# EAGLE design schematic (EAGLE 9.3.1)
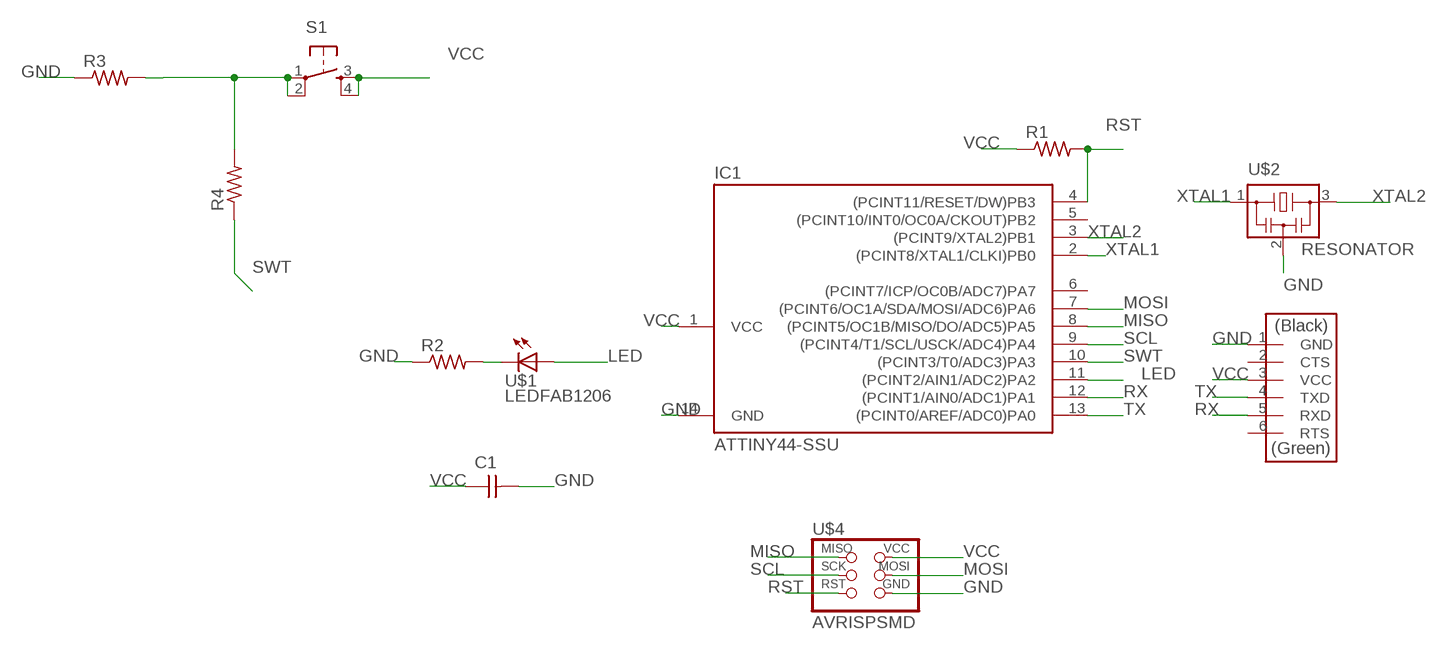
[diagram p0: schematic, sheet 1]

## Parts
C1  CAP-UNPOLARIZEDFAB  [C1206FAB]
IC1  ATTINY44-SSU  [SOIC14]
R1  RES-US1206FAB  [R1206FAB]
R2  RES-US1206FAB  [R1206FAB]
R3  RES-US1206FAB  [R1206FAB]
R4  RES-US1206FAB  [R1206FAB]
S1  6MM_SWITCH6MM_SWITCH  [6MM_SWITCH]
U$1  LEDFAB1206  [LED1206FAB]
U$2  RESONATOR  [EFOBM]
U$3  FTDI-SMD-HEADER  [1X06SMD]
U$4  AVRISPSMD  [2X03SMD]

## Nets
GND: C1.2 IC1.14(GND) R2.1 R3.1 U$2.2 U$3.1(GND) U$4.6(GND)
LED: IC1.11((PCINT2/AIN1/ADC2)PA2) U$1.1(A)
MISO: IC1.8((PCINT5/OC1B/MISO/DO/ADC5)PA5) U$4.1(MISO)
MOSI: IC1.7((PCINT6/OC1A/SDA/MOSI/ADC6)PA6) U$4.4(MOSI)
N$1: R2.2 U$1.2(C)
N$3: R3.2 R4.2 S1.1(P) S1.2(P1)
RST: IC1.4((PCINT11/RESET/DW)PB3) R1.2 U$4.5(RST)
RX: IC1.12((PCINT1/AIN0/ADC1)PA1) U$3.5(RXD)
SCL: IC1.9((PCINT4/T1/SCL/USCK/ADC4)PA4) U$4.3(SCK)
SWT: IC1.10((PCINT3/T0/ADC3)PA3) R4.1
TX: IC1.13((PCINT0/AREF/ADC0)PA0) U$3.4(TXD)
VCC: C1.1 IC1.1(VCC) R1.1 S1.3(S) S1.4(S1) U$3.3(VCC) U$4.2(VCC)
XTAL1: IC1.2((PCINT8/XTAL1/CLKI)PB0) U$2.1
XTAL2: IC1.3((PCINT9/XTAL2)PB1) U$2.3
Unconnected: IC1.5((PCINT10/INT0/OC0A/CKOUT)PB2) IC1.6((PCINT7/ICP/OC0B/ADC7)PA7) U$3.2(CTS) U$3.6(RTS)

## Library data of the parts
C1 = fab:CAP-UNPOLARIZED
IC1 = fab:ATTINY44
R1-R4 = fab:RES-US: Resistor (US Symbol) Variants with postfix FAB are widened to allow the routing of internal traces
S1 = fab:6MM_SWITCH: OMRON SWITCH
U$1 = fab:LED: LED
U$2 = fab:RESONATOR
U$3 = fab:FTDI-SMD-HEADER
U$4 = fab:AVRISP

## Board
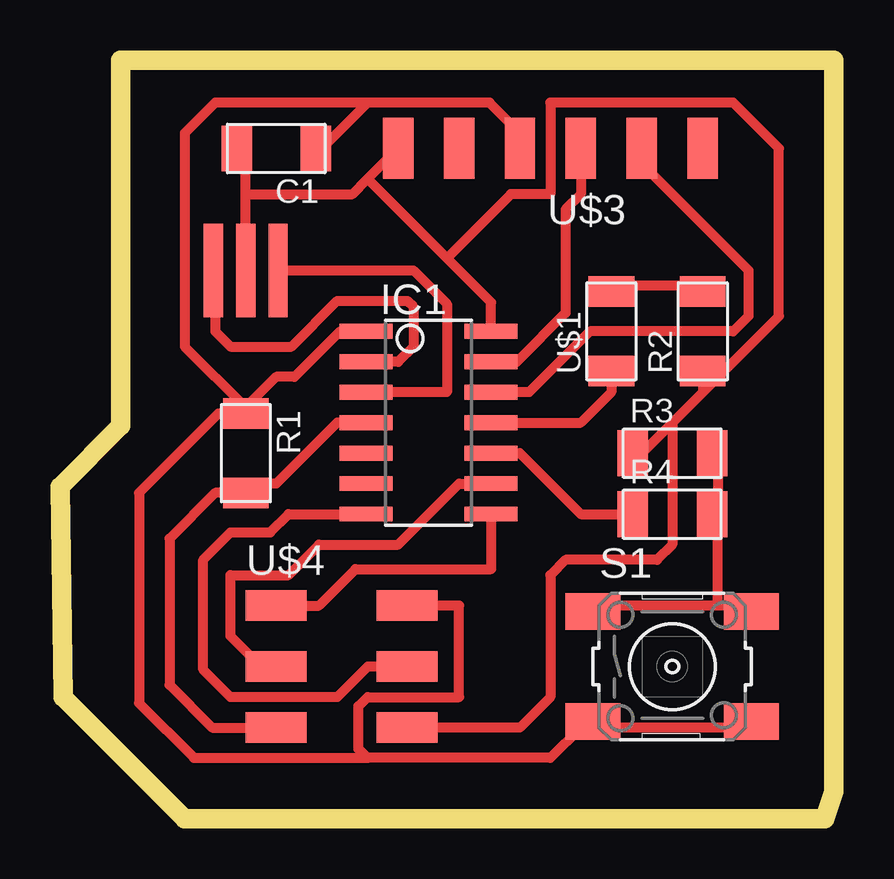
[diagram p1: board, top side]

Size 32.26 x 31.62 mm. Coordinates in mm from the lower left corner, seen from the top.
Outline: 5.21,0 31.88,0 32.26,1.14 32.26,31.62 2.54,31.62 2.54,16.38 0,13.84 0.13,5.08 5.21,0
Copper layers (1*16): Top 0.035mm / dielectric 1.5mm / Bottom 0.035mm
Design rules "default *": minimum track width 16mil, minimum drill 0.35mm, track to track 16mil, track to pad 16mil, pad to pad 16mil, via to via 16mil, smd to smd 16mil, copper to edge 40mil, drill to drill 6mil, minimum pad ring 10mil, minimum via ring 8mil, stop-mask expansion 4mil, vias tented up to drill 0mil, thermal gap 16mil

### Footprints (pad centres in the part's own frame; a part is rotated, then mirrored left to right if it is on the bottom)
C1206FAB = smd 1.27 x 1.905: 1 -1.651,0; 2 1.651,0
SOIC14 = smd 0.61 x 2.21: 1 -3.81,-2.603; 2 -2.54,-2.603; 3 -1.27,-2.603; 4 0,-2.603; 5 1.27,-2.603; 6 2.54,-2.603; 7 3.81,-2.603; 8 3.81,2.603; 9 2.54,2.603; 10 1.27,2.603; 11 0,2.603; 12 -1.27,2.603; 13 -2.54,2.603; 14 -3.81,2.603
R1206FAB = smd 1.27 x 1.905: 1 -1.651,0; 2 1.651,0
6MM_SWITCH = smd 2.286 x 1.524: 1 -3.302,2.286; 2 3.302,2.286; 3 -3.302,-2.286; 4 3.302,-2.286
LED1206FAB = smd 1.27 x 1.905: 1 -1.651,0; 2 1.651,0
EFOBM = smd 0.8 x 3.9: 1 -1.35,0; 2 0,0; 3 1.35,0
1X06SMD = smd 2.54 x 1.27: 1 0,6.35; 2 0,3.81; 3 0,1.27; 4 0,-1.27; 5 0,-3.81; 6 0,-6.35
2X03SMD = smd 2.54 x 1.27: 1 -2.54,2.54; 2 2.92,2.54; 3 -2.54,0; 4 2.92,0; 5 -2.54,-2.54; 6 2.92,-2.54

### Placement (x,y rotation side)
C1  9.02,27.94 180 top
IC1  15.37,16.51 270 top
R1  7.75,15.24 270 top
R2  26.8,20.32 90 top
R3  25.53,15.24 0 top
R4  25.53,12.7 0 top
S1  25.53,6.35 0 top
U$1  22.99,20.32 90 top
U$2  7.75,22.86 0 top
U$3  20.45,27.94 90 top
U$4  11.56,6.35 0 top

### Tracks (layer width: path | path; a pad name or v marks a point on that pad's centre or on a via)
GND
  Top 0.406: U$2.2 7.75,26.04 | 7.75,26.04 7.75,27.94 C1.2 | 12.83,26.67 16.13,23.37 | IC1.14 17.97,21.53 16.13,23.37 | 7.75,26.04 12.19,26.04 12.83,26.67 | 12.83,26.67 U$3.1 | 26.8,17.78 25.53,16.51 | 25.53,16.51 24.26,15.24 R3.1 | R2.1 26.8,17.78 | U$4.6 19.18,3.81 20.45,5.08 20.45,10.16 21.08,10.8 24.89,10.8 25.53,11.43 25.53,16.51 | 16.13,23.37 18.8,26.04 20.45,26.04 20.45,29.84 28.07,29.84 29.97,27.94 29.97,20.95 26.8,17.78
LED
  Top 0.406: U$1.1 22.99,17.78 21.72,16.51 IC1.11
MISO
  Top 0.406: IC1.8 17.97,10.41 12.32,10.41 10.79,8.89 U$4.1
MOSI
  Top 0.406: IC1.7 9.53,12.7 8.76,11.94 7.11,11.94 5.97,10.8 5.97,6.22 7.11,5.08 11.56,5.08 12.83,6.35 U$4.4
N$1
  Top 0.406: U$1.2 22.99,22.23 26.8,22.23 R2.2
N$3
  Top 0.406: 27.43,12.7 27.43,15.24 R3.2 | 27.43,8.89 28.7,8.89 S1.2 | 27.43,8.89 22.35,8.89 S1.1 | 27.43,8.89 27.43,12.7 | 27.43,12.7 R4.2
RST
  Top 0.406: IC1.4 11.56,16.51 9.02,13.97 7.75,13.97 R1.2 6.48,13.59 4.57,11.68 4.57,5.59 6.35,3.81 U$4.5
RX
  Top 0.406: IC1.12 19.56,17.78 22.1,20.32 28.07,20.32 28.7,20.95 28.7,22.86 24.26,27.3 U$3.5
SCL
  Top 0.406: IC1.9 16.64,13.97 14.1,11.43 10.79,11.43 9.53,10.16 7.11,10.16 7.11,7.62 8.38,6.35 U$4.3
SWT
  Top 0.406: R4.1 21.72,12.7 19.18,15.24 IC1.10
TX
  Top 0.406: IC1.13 19.05,19.05 21.08,21.08 21.08,25.4 21.72,26.04 U$3.4
VCC
  Top 0.406: S1.4 28.7,3.81 22.35,3.81 S1.3 21.72,3.81 20.45,2.54 12.83,2.54 | 12.83,2.54 12.45,2.92 12.45,4.7 12.83,5.08 16.64,5.08 16.64,8.89 U$4.2 | 7.75,17.14 9.02,18.41 9.78,18.41 11.68,20.32 IC1.1 | 12.83,29.84 10.92,27.94 C1.1 | 12.83,29.84 17.91,29.84 19.18,28.58 U$3.3 | 7.75,17.14 5.21,19.68 5.21,28.58 6.48,29.84 12.83,29.84 | 7.75,17.14 R1.1 6.6,16.89 3.3,13.59 3.3,4.83 5.59,2.54 12.83,2.54
XTAL1
  Top 0.406: IC1.2 14.1,19.05 14.73,19.68 14.73,21.34 14.48,21.59 11.56,21.59 9.65,19.68 7.11,19.68 6.48,20.32 6.48,22.86 U$2.1
XTAL2
  Top 0.406: IC1.3 16.13,17.78 16.13,21.46 14.73,22.86 U$2.3 9.02,22.86